# EAGLE design BLUEPILL_full_schematic for BRD (EAGLE 9.6.2)
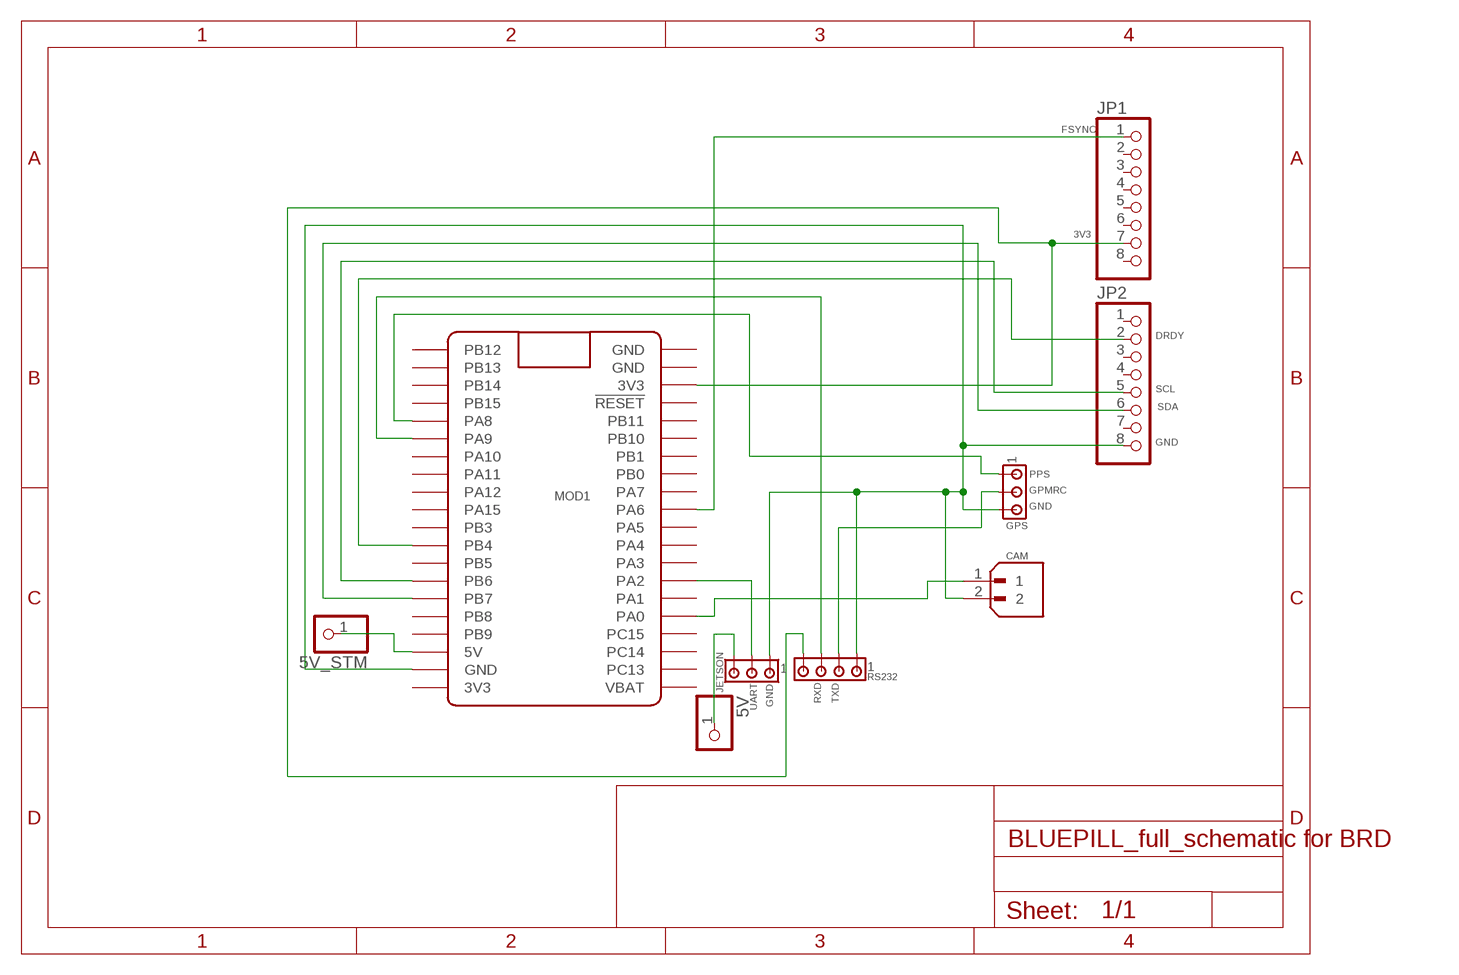
[diagram p0: schematic, sheet 1]

## Parts
5V  PINHD-1X1  [1X01]
5V_STM  PINHD-1X1  [1X01]
CAM  B2B-XH-A  [JST_B2B-XH-A]
GPS  MTA03-100  [10X03MTA]
JETSON  MTA03-100  [10X03MTA]
JP1  PINHD-1X8  [1X08]
JP2  PINHD-1X8  [1X08]
MOD1  BLUE_PILL  [BLUE_PILL]
RS232  MTA04-100  [10X04MTA]

## Nets
3V3: JP1.7 MOD1.P$23(3V3) RS232.4
DRDY: JP2.2 MOD1.P$12(PB4)
FSYNC: JP1.1 MOD1.P$30(PA6)
GND: CAM.2 GPS.3 JETSON.1 JP2.8 MOD1.P$19(GND) RS232.1
N$2: 5V_STM.1 MOD1.P$18(5V)
N$3: 5V.1 JETSON.3
N$6: CAM.1 MOD1.P$36(PA0)
PPS: GPS.1 MOD1.P$5(PA8)
RXD: MOD1.P$6(PA9) RS232.3
SCL: JP2.5 MOD1.P$14(PB6)
SDA: JP2.6 MOD1.P$15(PB7)
TXD: GPS.2 RS232.2
UART: JETSON.2 MOD1.P$34(PA2)
Unconnected: JP1.2 JP1.3 JP1.4 JP1.5 JP1.6 JP1.8 JP2.1 JP2.3 JP2.4 JP2.7 MOD1.P$1(PB12) MOD1.P$2(PB13) MOD1.P$3(PB14) MOD1.P$4(PB15) MOD1.P$7(PA10) MOD1.P$8(PA11) MOD1.P$9(PA12) MOD1.P$10(PA15) MOD1.P$11(PB3) MOD1.P$13(PB5) MOD1.P$16(PB8) MOD1.P$17(PB9) MOD1.P$20(3V3) MOD1.P$21(GND) MOD1.P$22(GND) MOD1.P$24(!RESET) MOD1.P$25(PB11) MOD1.P$26(PB10) MOD1.P$27(PB1) MOD1.P$28(PB0) MOD1.P$29(PA7) MOD1.P$31(PA5) MOD1.P$32(PA4) MOD1.P$33(PA3) MOD1.P$35(PA1) MOD1.P$37(PC15) MOD1.P$38(PC14) MOD1.P$39(PC13) MOD1.P$40(VBAT)

## Notes on the sheet
- GPMRC
- GND
- GND
- UART

## Library data of the parts
5V 5V_STM = pinhead:PINHD-1X1: PIN HEADER
CAM = B2B-XH-A Model:B2B-XH-A: Check availability <https://pricing.snapeda.com/parts/B2B-XH-A/JST%20Sales/view-part?ref=eda>; AVAILABILITY: In Stock; CHECK_PRICES: https://www.snapeda.com/parts/B2B-XH-A/JST/view-part/?ref=eda; DESCRIPTION: Connector Header Through Hole 2 position 0.098 (2.50mm); MF: JST Sales; MP: B2B-XH-A; PACKAGE: None; PRICE: None; SNAPEDA_LINK: https://www.snapeda.com/parts/B2B-XH-A/JST/view-part/?ref=snap
GPS JETSON = con-amp:MTA03-100: AMP connector
JP1 JP2 = pinhead:PINHD-1X8: PIN HEADER
MOD1 = BluePill:BLUE_PILL
RS232 = con-amp:MTA04-100: AMP connector

## Net classes
0 default: width 1.016 mm

## Board
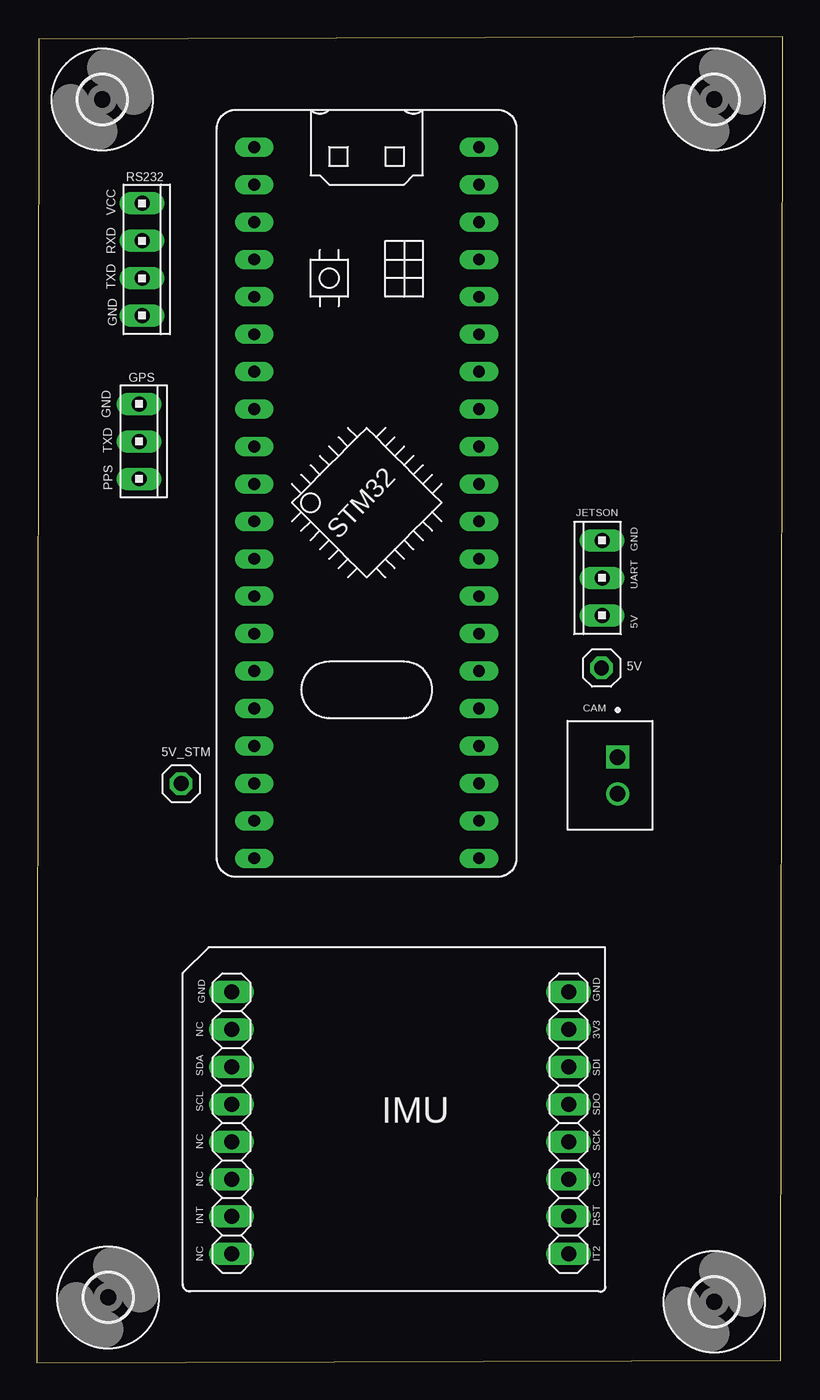
[diagram p1: board, top side]
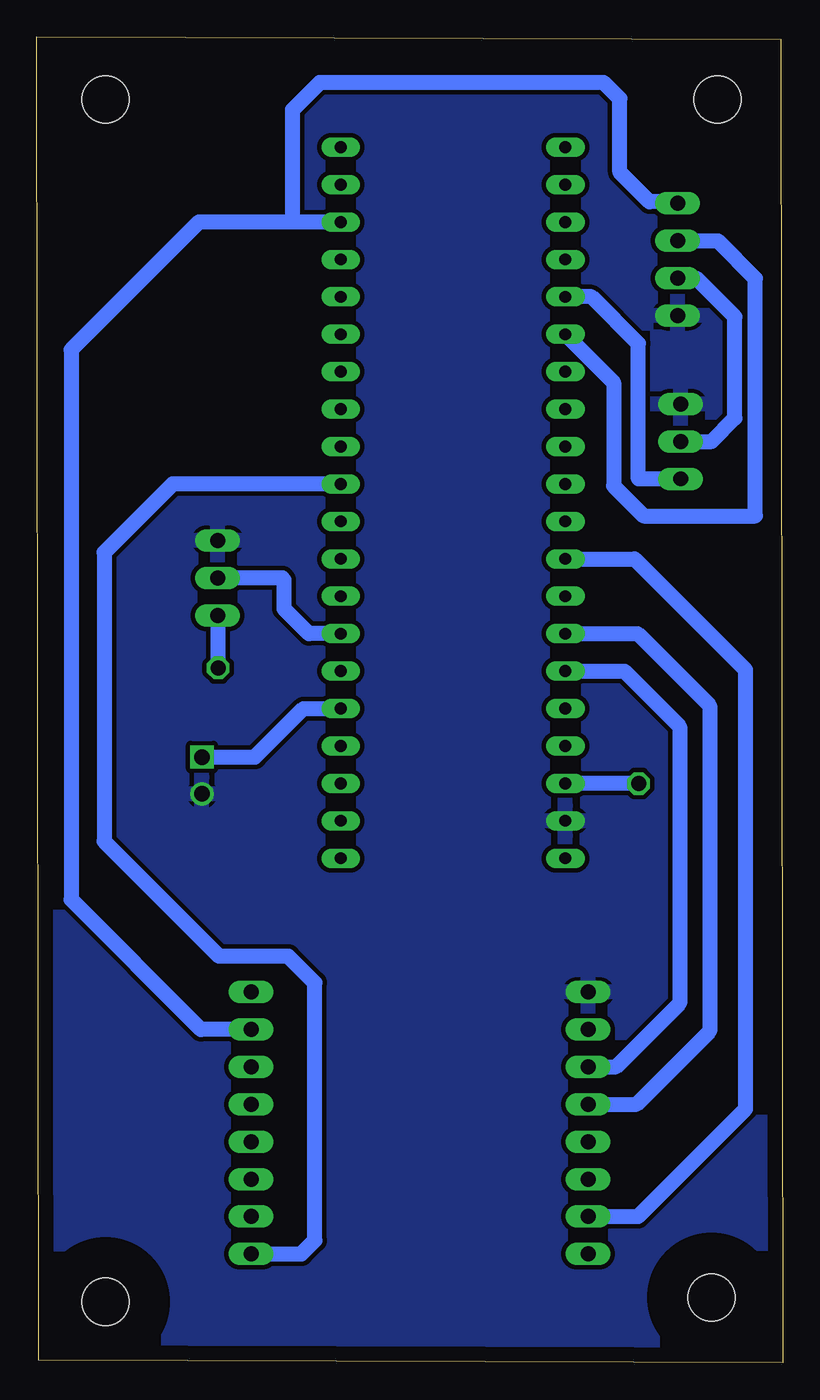
[diagram p2: board, bottom side, seen from below]

Size 50.62 x 89.99 mm. Coordinates in mm from the lower left corner, seen from the top.
Outline: 0,0 50.49,0.15 50.62,89.99 0.13,89.84 0,0
Copper layers (1*16): Top 0.035mm / dielectric 1.5mm / Bottom 0.035mm
Design rules "default": minimum track width 6mil, minimum drill 0.35mm, track to track 6mil, track to pad 6mil, pad to pad 6mil, via to via 6mil, smd to smd 6mil, copper to edge 40mil, drill to drill 6mil, minimum pad ring 10mil, minimum via ring 8mil, stop-mask expansion 4mil, vias tented up to drill 0mil, thermal gap 10mil

### Footprints (pad centres in the part's own frame; a part is rotated, then mirrored left to right if it is on the bottom)
1X01 = drill 1.016 octagon: 1 0,0
JST_B2B-XH-A = drill 1.05 square: 1 1.25,-0.525 | drill 1.05: 2 -1.25,-0.525
10X03MTA = drill 1.016 long: 1 2.54,0; 2 0,0; 3 -2.54,0
1X08 = drill 1.016 long: 1 -8.89,0; 2 -6.35,0; 3 -3.81,0; 4 -1.27,0; 5 1.27,0; 6 3.81,0; 7 6.35,0; 8 8.89,0
BLUE_PILL = drill 0.8 long: P$1 -7.62,15.24; P$2 -7.62,12.7; P$3 -7.62,10.16; P$4 -7.62,7.62; P$5 -7.62,5.08; P$6 -7.62,2.54; P$7 -7.62,0; P$8 -7.62,-2.54; P$9 -7.62,-5.08; P$10 -7.62,-7.62; P$11 -7.62,-10.16; P$12 -7.62,-12.7; P$13 -7.62,-15.24; P$14 -7.62,-17.78; P$15 -7.62,-20.32; P$16 -7.62,-22.86; P$17 -7.62,-25.4; P$18 -7.62,-27.94; P$19 -7.62,-30.48; P$20 -7.62,-33.02; P$21 7.62,15.24; P$22 7.62,12.7; P$23 7.62,10.16; P$24 7.62,7.62; P$25 7.62,5.08; P$26 7.62,2.54; P$27 7.62,0; P$28 7.62,-2.54; P$29 7.62,-5.08; P$30 7.62,-7.62; P$31 7.62,-10.16; P$32 7.62,-12.7; P$33 7.62,-15.24; P$34 7.62,-17.78; P$35 7.62,-20.32; P$36 7.62,-22.86; P$37 7.62,-25.4; P$38 7.62,-27.94; P$39 7.62,-30.48; P$40 7.62,-33.02
10X04MTA = drill 1.016 long: 1 3.81,0; 2 1.27,0; 3 -1.27,0; 4 -3.81,0
3,2 = hole 3.2: 0,0

### Placement (x,y rotation side)
5V  38.31,47.15 0 top
5V_STM  9.79,39.3 0 top
CAM  38.89,39.86 90 top
GPS  6.94,62.53 270 top
JETSON  38.35,53.26 90 top
JP1  36.08,16.27 90 top
JP2  13.22,16.27 90 top
MOD1  22.38,67.26 0 top
RS232  7.14,74.88 270 top
U$1  [3,2]  4.44,85.74 0 top
U$2  [3,2]  45.96,85.74 0 top
U$3  [3,2]  4.84,4.43 0 top
U$4  [3,2]  45.96,4.13 0 top

### Tracks (layer width: path | path; a pad name or v marks a point on that pad's centre or on a via)
3V3
  Bottom 1.016: JP1.7 39.49,22.62 48.3,31.43 48.3,68.75 39.63,77.42 33.26,77.42 | MOD1.P$23 33.26,77.42 | 33.26,77.42 33.26,85.06 31.43,86.89 12.16,86.89 11.06,85.79 11.06,80.79 9.06,78.79 7.14,78.79 RS232.4
DRDY
  Bottom 1.016: JP2.2 9.82,9.92 2.54,17.2 2.54,47.04 10.06,54.56 MOD1.P$12
FSYNC
  Bottom 1.016: MOD1.P$30 41.41,59.64 46.06,54.99 46.06,35.39 38.26,27.59 33.56,27.59 31.76,25.79 31.76,8.29 32.67,7.38 JP1.1
GND
  pour Bottom (isolate 0.305): 0.06,89.79 0.06,-0.21 50.06,-0.21 50.06,89.79
N$2
  Bottom 1.016: 5V_STM.1 14.76,39.3 MOD1.P$18
N$3
  Bottom 1.016: 5V.1 38.31,50.72 JETSON.3
N$6
  Bottom 1.016: MOD1.P$36 32.54,44.4 35.83,41.11 CAM.1
PPS
  Bottom 1.016: MOD1.P$5 12.98,72.34 9.81,69.17 9.81,59.99 GPS.1
RXD
  Bottom 1.016: RS232.3 4.42,76.15 1.86,73.59 1.86,57.47 9.44,57.47 11.48,59.51 11.48,66.52 MOD1.P$6
SCL
  Bottom 1.016: JP2.5 9.92,17.54 4.97,22.49 4.97,44.59 9.86,49.48 MOD1.P$14
SDA
  Bottom 1.016: MOD1.P$15 10.76,46.94 7,43.18 7,24.4 11.32,20.08 JP2.6
TXD
  Bottom 1.016: RS232.2 5.87,73.61 3.25,70.99 3.25,64.1 4.82,62.53 GPS.2
UART
  Bottom 1.016: MOD1.P$34 32.16,49.48 33.83,51.16 33.83,53.14 33.96,53.26 JETSON.2

### Text on the board
tNames: VCC | RXD | TXD | GND | GND | TXD | PPS | GND | UART | 5V | GND | GND | NC | 3V3 | SDA | SDI | SCL | SDO | IMU | NC | SCK | NC | CS | INT | RST | NC | IT2